# EAGLE board rf_test (EAGLE 5.12)
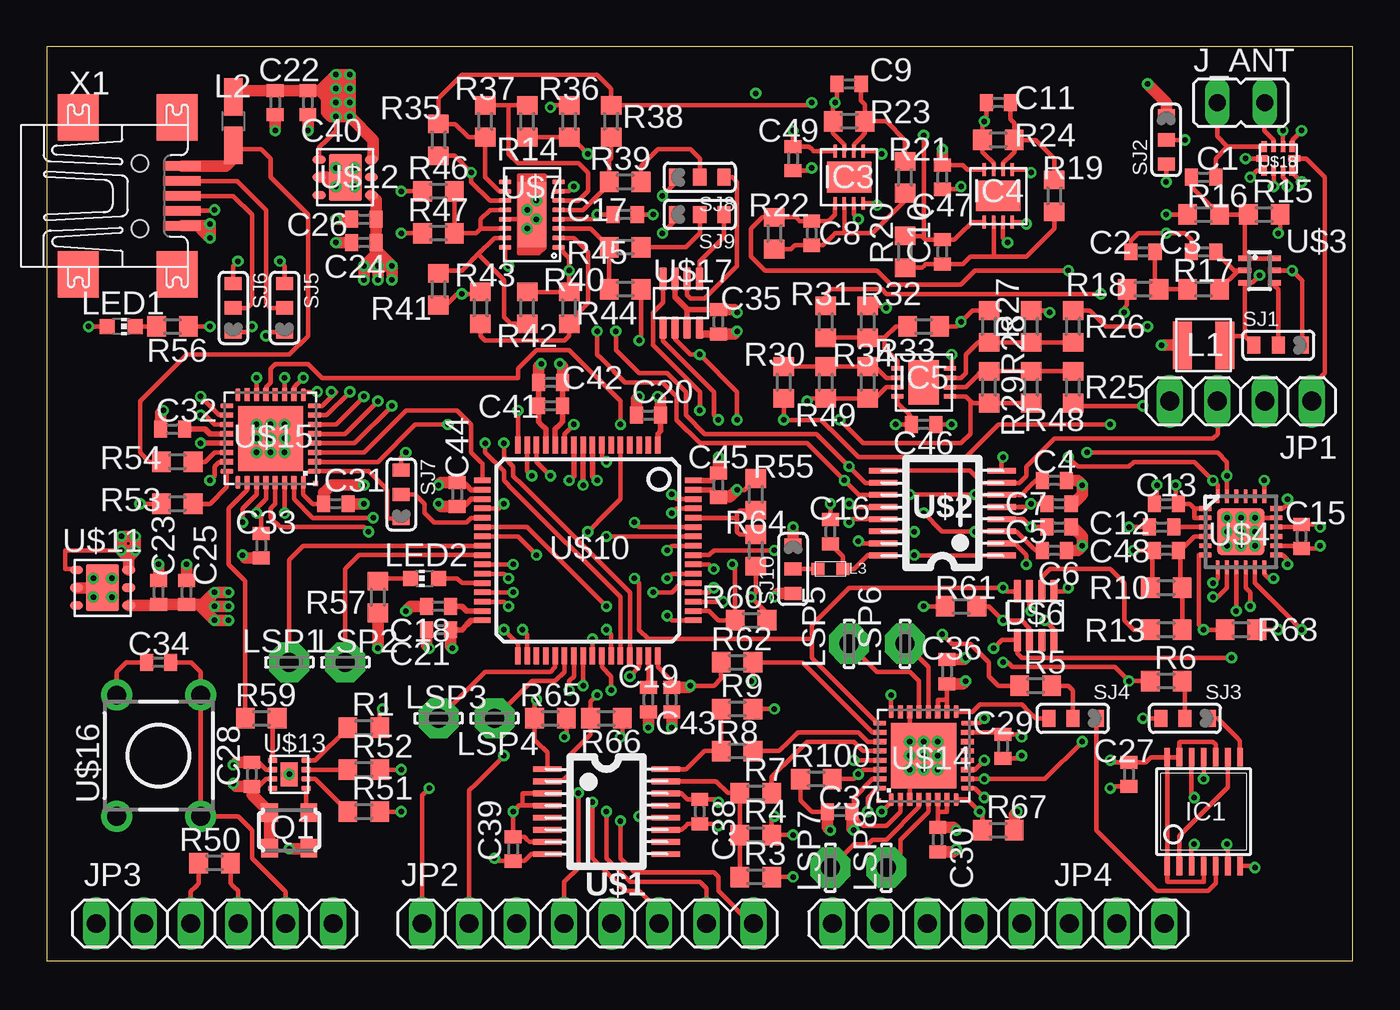
[diagram p4: board, top side]
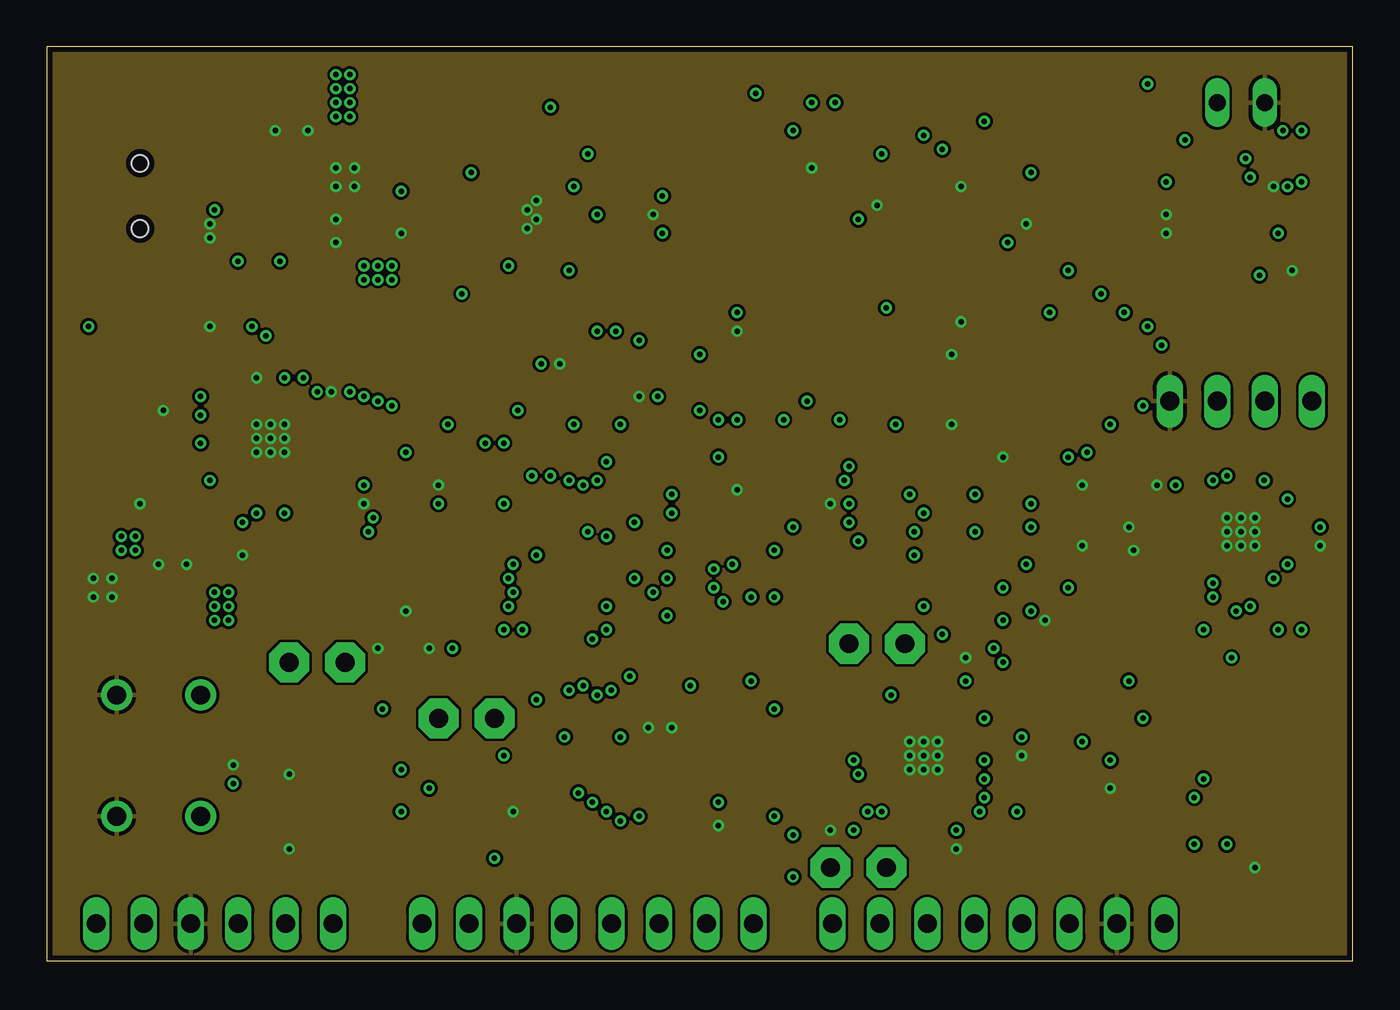
[diagram p5: board, inner layer Route2]
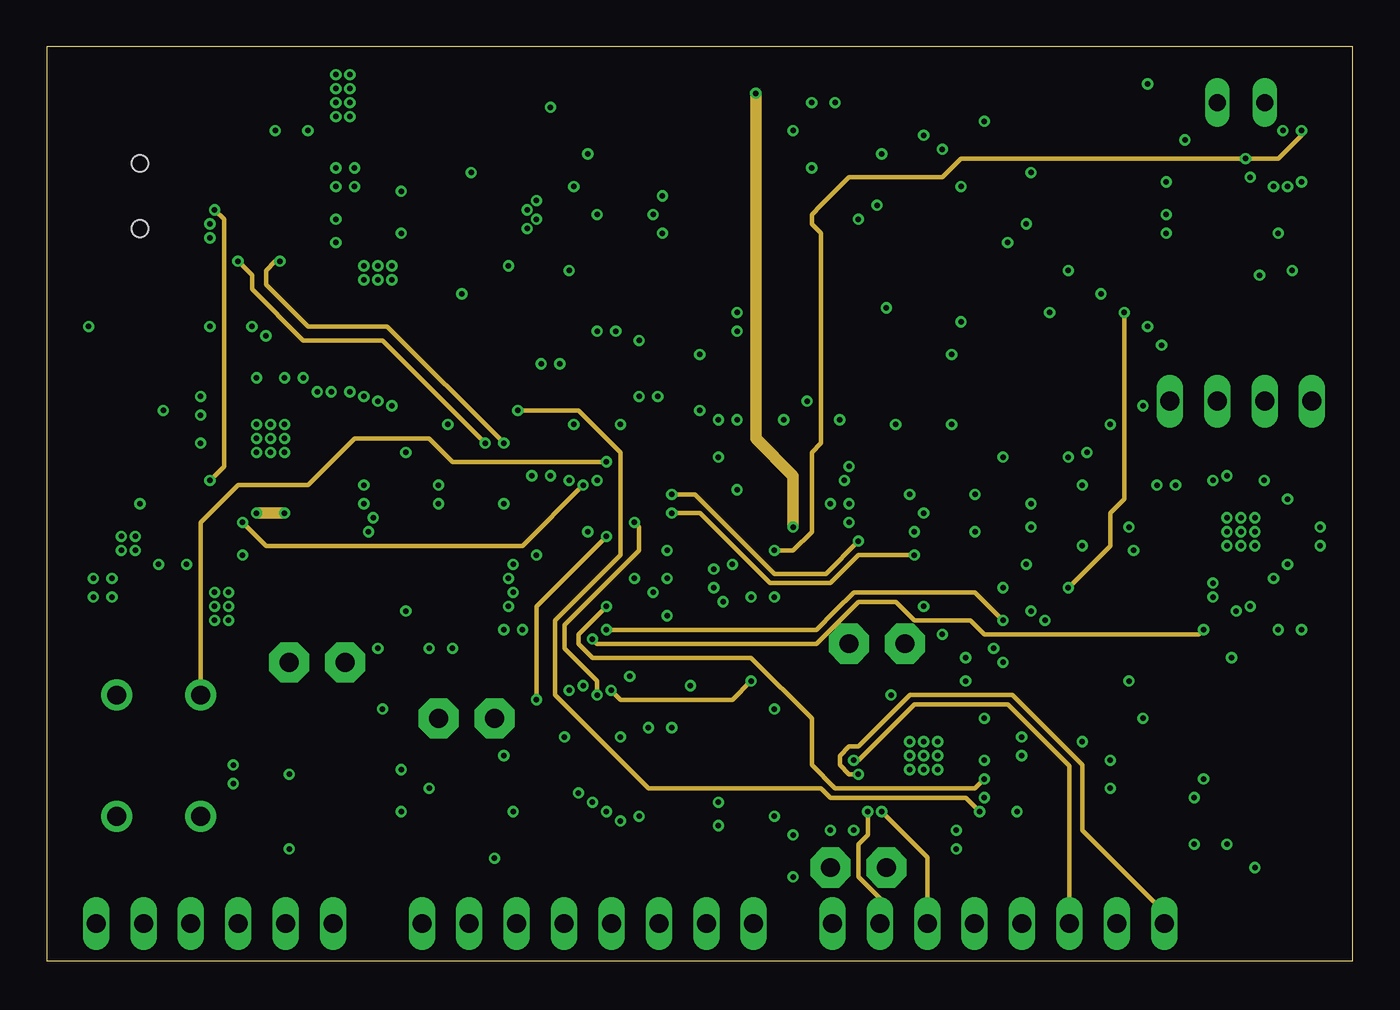
[diagram p6: board, inner layer Route3]
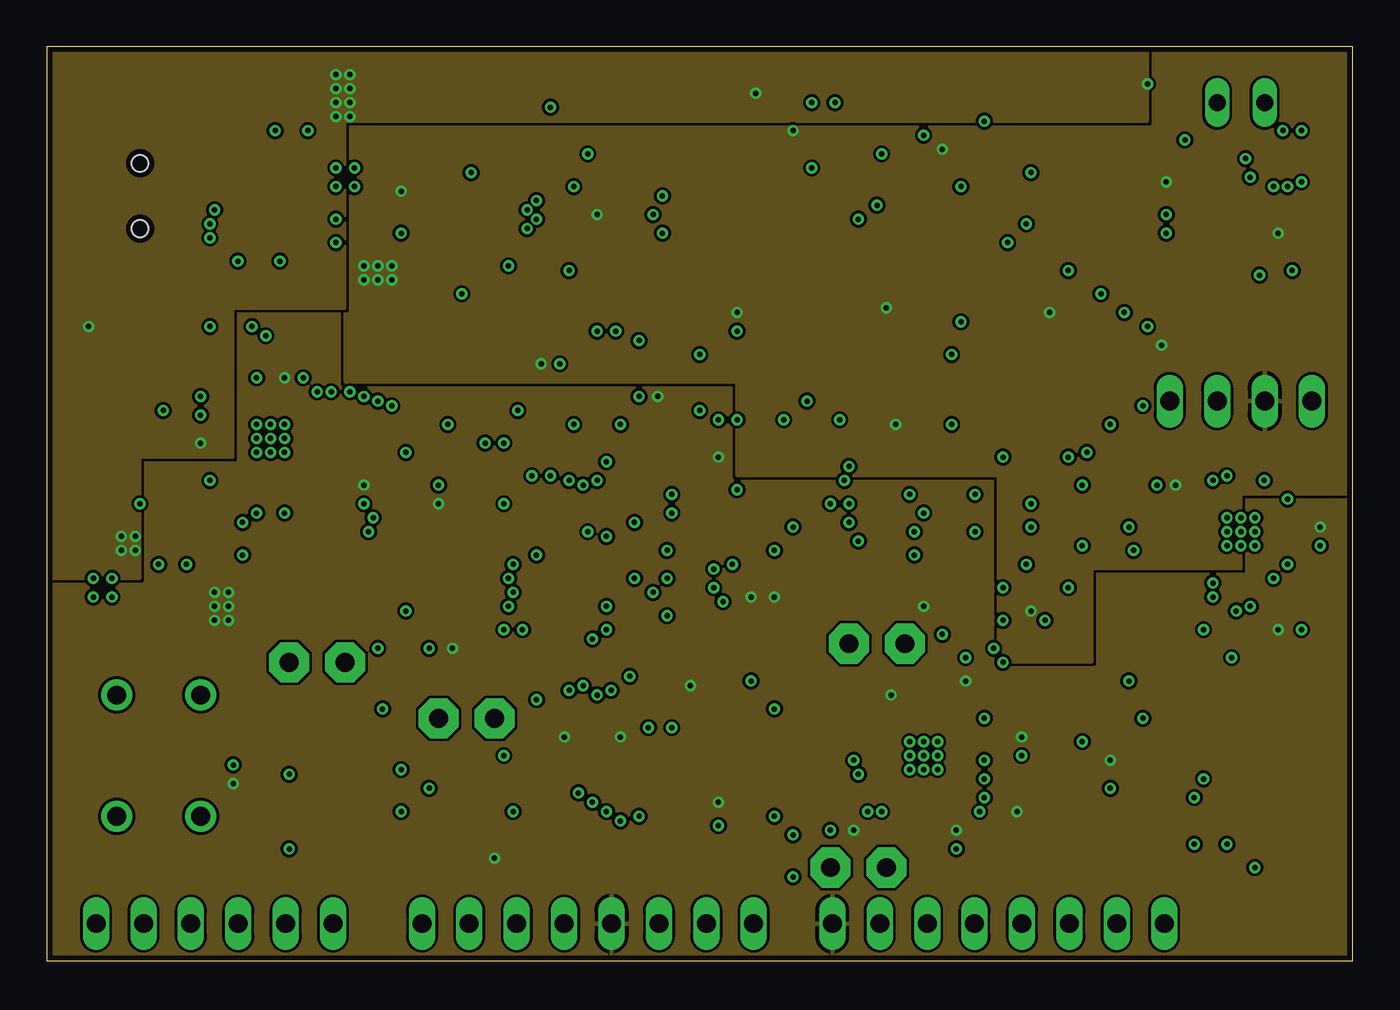
[diagram p7: board, inner layer Route14]
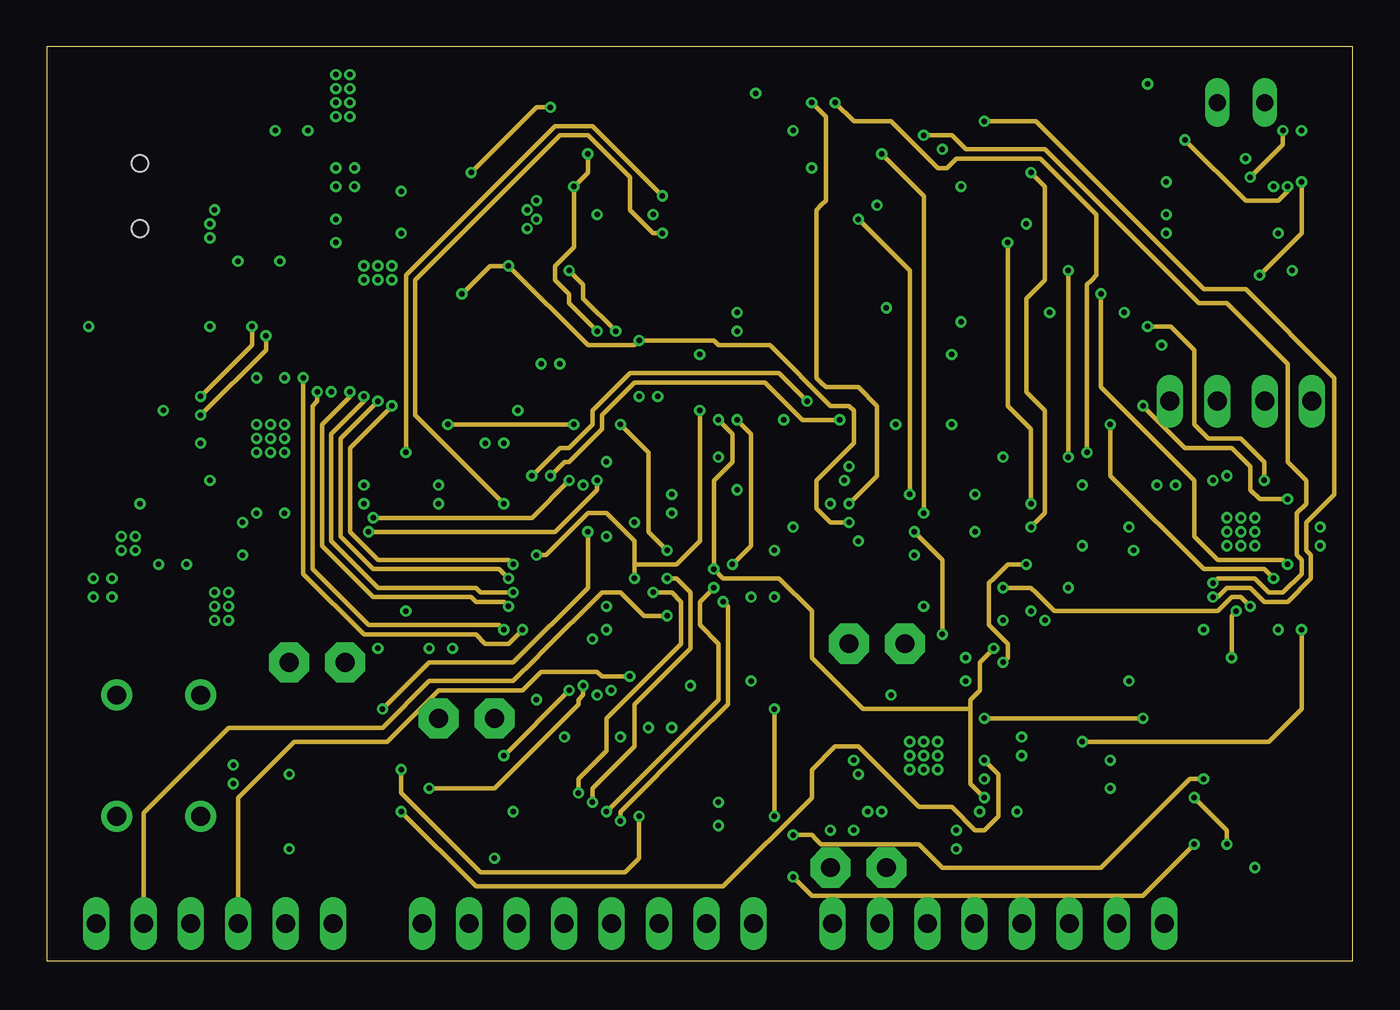
[diagram p8: board, inner layer Route15]
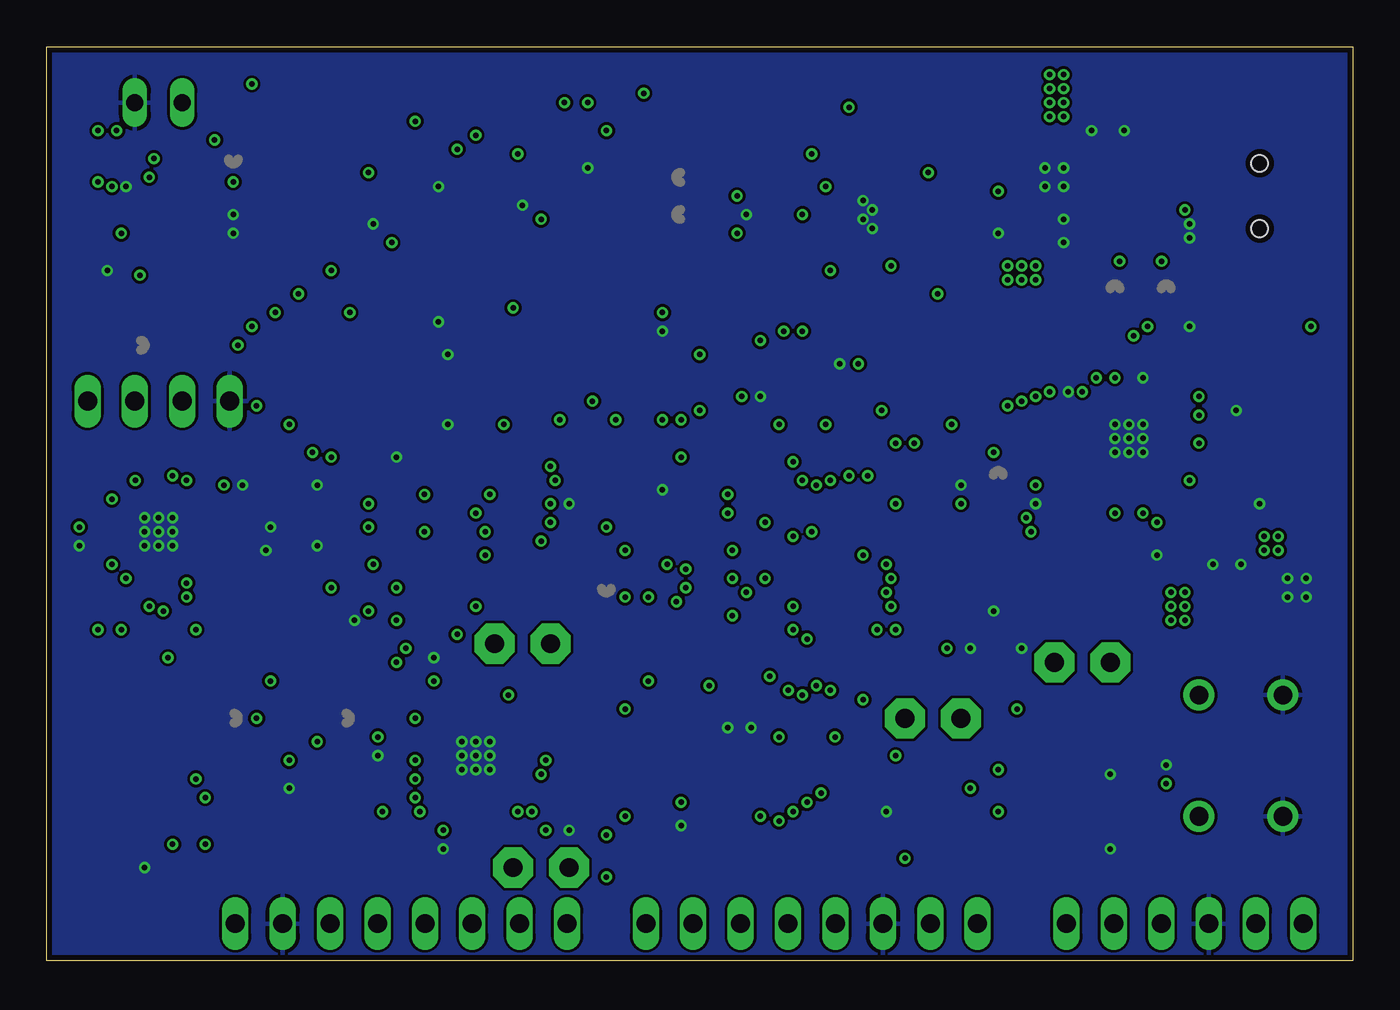
[diagram p9: board, bottom side, seen from below]

Size 70 x 49 mm. Coordinates in mm from the lower left corner, seen from the top.
Outline: 0,0 70,0 70,49 0,49 0,0
Copper layers (1+2+3*14+15+16): Top 0.035mm / dielectric 0.2mm / Route2 0.035mm / dielectric 0.36mm / Route3 0.035mm / dielectric 0.28mm / Route14 0.035mm / dielectric 0.36mm / Route15 0.035mm / dielectric 0.2mm / Bottom 0.035mm
Design rules "PCB-POOL Standard_ML6 *": minimum track width 0.15mm, minimum drill 0.3mm, track to track 0.15mm, track to pad 0.15mm, pad to pad 0.15mm, via to via 0.15mm, smd to smd 0.15mm, copper to edge 0.3mm, drill to drill 0.2mm, minimum pad ring 0.2mm, minimum via ring 0.15mm, stop-mask expansion 0.075mm, vias tented up to drill 0mil, thermal gap 0.2mm

## Footprints (pad centres in the part's own frame; a part is rotated, then mirrored left to right if it is on the bottom)
C0402 = smd 0.7 x 0.9: 1 -0.65,0; 2 0.65,0
TSSOP14 = smd 0.305 x 0.991: 1 -1.95,-2.918; 2 -1.3,-2.918; 3 -0.65,-2.918; 4 0,-2.918; 5 0.65,-2.918; 6 1.3,-2.918; 7 1.95,-2.918; 8 1.95,2.918; 9 1.3,2.918; 10 0.65,2.918; 11 0,2.918; 12 -0.65,2.918; 13 -1.3,2.918; 14 -1.95,2.918
DFN8-3X3 = smd 0.25 x 0.7: 1 -0.75,-1.4; 2 -0.25,-1.4; 3 0.25,-1.4; 4 0.75,-1.4; 5 0.75,1.4; 6 0.25,1.4; 7 -0.25,1.4; 8 -0.75,1.4 | smd 2.38 x 1.65: EXP 0,0
JP1 = drill 0.914 long: 1 0,-1.27; 2 0,1.27
1X04 = drill 1.016 long: 1 -3.81,0; 2 -1.27,0; 3 1.27,0; 4 3.81,0
1X08 = drill 1.016 long: 1 -8.89,0; 2 -6.35,0; 3 -3.81,0; 4 -1.27,0; 5 1.27,0; 6 3.81,0; 7 6.35,0; 8 8.89,0
1X06 = drill 1.016 long: 1 -6.35,0; 2 -3.81,0; 3 -1.27,0; 4 1.27,0; 5 3.81,0; 6 6.35,0
L1008 = smd 1.016 x 2.54: 1 -1.143,0; 2 1.143,0
L0805 = smd 2 x 1: 1 -1.3,0; 2 1.3,0
L0603 = smd 0.7 x 0.65: 1 -0.675,0; 2 0.675,0
CHIP-LED0603 = smd 0.8 x 0.8: A 0,-0.75; C 0,0.75
LSP10 = drill 1.016 pad 2.159 octagon: MP 0,0
ASEMB = smd 0.9 x 1: 1 -1.05,-0.95; 2 1.05,-0.95; 3 1.05,0.95; 4 -1.05,0.95
R0603 = smd 1 x 1.1: 1 -0.85,0; 2 0.85,0
SJ_2_0402 = smd 0.7 x 0.9: 1 -1.3,0; 2 0,0; 3 1.3,0
TSSOP16 = smd 0.305 x 1.524: 1 -2.275,-3.169; 2 -1.625,-3.169; 3 -0.975,-3.169; 4 -0.325,-3.169; 5 0.325,-3.169; 6 0.975,-3.169; 7 1.625,-3.169; 8 2.275,-3.169; 9 2.275,3.169; 10 1.625,3.169; 11 0.975,3.169; 12 0.325,3.169; 13 -0.325,3.169; 14 -0.975,3.169; 15 -1.625,3.169; 16 -2.275,3.169
SOT363_INFINEON = smd 0.3 x 0.7: 1 -0.65,-0.8; 2 0,-0.8; 3 0.65,-0.8; 4 0.65,0.8; 5 0,0.8; 6 -0.65,0.8
QFN24_4X4MM = smd 0.7 x 0.25: 1 -1.9,1.25; 2 -1.9,0.75; 3 -1.9,0.25; 4 -1.9,-0.25; 5 -1.9,-0.75; 6 -1.9,-1.25; 13 1.9,-1.25; 14 1.9,-0.75; 15 1.9,-0.25; 16 1.9,0.25; 17 1.9,0.75; 18 1.9,1.25 | smd 0.25 x 0.7: 7 -1.25,-1.9; 8 -0.75,-1.9; 9 -0.25,-1.9; 10 0.25,-1.9; 11 0.75,-1.9; 12 1.25,-1.9; 19 1.25,1.9; 20 0.75,1.9; 21 0.25,1.9; 22 -0.25,1.9; 23 -0.75,1.9; 24 -1.25,1.9 | smd 2.54 x 2.54: PAD 0,0
TSOT23-8 = smd 0.4 x 1.22: 1 -0.975,-1.31; 2 -0.325,-1.31; 3 0.325,-1.31; 4 0.975,-1.31; 5 0.975,1.31; 6 0.325,1.31; 7 -0.325,1.31; 8 -0.975,1.31
DFN16_5X3MM = smd 0.25 x 0.65: 1 -1.75,-1.425; 2 -1.25,-1.425; 3 -0.75,-1.425; 4 -0.25,-1.425; 5 0.25,-1.425; 6 0.75,-1.425; 7 1.25,-1.425; 8 1.75,-1.425; 9 1.75,1.425; 10 1.25,1.425; 11 0.75,1.425; 12 0.25,1.425; 13 -0.25,1.425; 14 -0.75,1.425; 15 -1.25,1.425; 16 -1.75,1.425 | smd 3.5 x 1.5: PAD 0,0
LQFP-ST-64-2 = smd 0.9 x 0.3: 1 -5.65,3.75; 2 -5.65,3.25; 3 -5.65,2.75; 4 -5.65,2.25; 5 -5.65,1.75; 6 -5.65,1.25; 7 -5.65,0.75; 8 -5.65,0.25; 9 -5.65,-0.25; 10 -5.65,-0.75; 11 -5.65,-1.25; 12 -5.65,-1.75; 13 -5.65,-2.25; 14 -5.65,-2.75; 15 -5.65,-3.25; 16 -5.65,-3.75; 33 5.65,-3.75; 34 5.65,-3.25; 35 5.65,-2.75; 36 5.65,-2.25; 37 5.65,-1.75; 38 5.65,-1.25; 39 5.65,-0.75; 40 5.65,-0.25; 41 5.65,0.25; 42 5.65,0.75; 43 5.65,1.25; 44 5.65,1.75; 45 5.65,2.25; 46 5.65,2.75; 47 5.65,3.25; 48 5.65,3.75 | smd 0.3 x 0.9: 17 -3.75,-5.65; 18 -3.25,-5.65; 19 -2.75,-5.65; 20 -2.25,-5.65; 21 -1.75,-5.65; 22 -1.25,-5.65; 23 -0.75,-5.65; 24 -0.25,-5.65; 25 0.25,-5.65; 26 0.75,-5.65; 27 1.25,-5.65; 28 1.75,-5.65; 29 2.25,-5.65; 30 2.75,-5.65; 31 3.25,-5.65; 32 3.75,-5.65; 49 3.75,5.65; 50 3.25,5.65; 51 2.75,5.65; 52 2.25,5.65; 53 1.75,5.65; 54 1.25,5.65; 55 0.75,5.65; 56 0.25,5.65; 57 -0.25,5.65; 58 -0.75,5.65; 59 -1.25,5.65; 60 -1.75,5.65; 61 -2.25,5.65; 62 -2.75,5.65; 63 -3.25,5.65; 64 -3.75,5.65
DFN6-3X3 = smd 0.45 x 0.7: 1 -0.95,-1.4; 2 0,-1.4; 3 0.95,-1.4; 4 0.95,1.4; 5 0,1.4; 6 -0.95,1.4 | smd 2.5 x 1.75: EXP 0,0
DFN8-3X3' = smd 0.3 x 0.5: 1 -0.75,-0.9; 2 -0.25,-0.9; 3 0.25,-0.9; 4 0.75,-0.9; 5 0.75,0.9; 6 0.25,0.9; 7 -0.25,0.9; 8 -0.75,0.9 | smd 1.3 x 0.9: EXP 0,0
HVQFN32 = smd 0.7 x 0.28: 1 -2.35,1.75; 2 -2.35,1.25; 3 -2.35,0.75; 4 -2.35,0.25; 5 -2.35,-0.25; 6 -2.35,-0.75; 7 -2.35,-1.25; 8 -2.35,-1.75; 17 2.35,-1.75; 18 2.35,-1.25; 19 2.35,-0.75; 20 2.35,-0.25; 21 2.35,0.25; 22 2.35,0.75; 23 2.35,1.25; 24 2.35,1.75 | smd 0.28 x 0.7: 9 -1.75,-2.35; 10 -1.25,-2.35; 11 -0.75,-2.35; 12 -0.25,-2.35; 13 0.25,-2.35; 14 0.75,-2.35; 15 1.25,-2.35; 16 1.75,-2.35; 25 1.75,2.35; 26 1.25,2.35; 27 0.75,2.35; 28 0.25,2.35; 29 -0.25,2.35; 30 -0.75,2.35; 31 -1.25,2.35; 32 -1.75,2.35 | smd 3.5 x 3.5: EXP 0,0 | smd 0.25 x 0.25: M1 -2.415,2.415
TL1105 = drill 1 pad 1.676 round: 1 -2.25,3.25; 2 -2.25,-3.25; 3 2.25,-3.25; 4 2.25,3.25
R-PUQFN-N10 = smd 0.3 x 0.58: 1 -0.75,-0.635; 4 0.75,-0.635; 6 0.75,0.635; 9 -0.75,0.635 | smd 0.25 x 0.58: 2 -0.25,-0.635; 3 0.25,-0.635; 7 0.25,0.635; 8 -0.25,0.635 | smd 0.63 x 0.35: 5 0.86,0; 10 -0.86,0
UX60-MB-5ST = smd 2 x 0.5: 1 2.25,1.6; 2 2.25,0.8; 3 2.25,0; 4 2.25,-0.8; 5 2.25,-1.6 | smd 2.2 x 2.5: M1 -3.3,-4.2; M2 -3.3,4.2; M3 2,4.2; M4 2,-4.2 | hole 0.9: 0,-1.75; 0,1.75

## Placement (x,y rotation side)
C1  4n7  [C0402]  62,42 180 top
C2  10n  [C0402]  58.75,38 180 top
C3  10n  [C0402]  62,38 180 top
C4  220p  [C0402]  54,25.75 0 top
C5  220p  [C0402]  54.25,24.5 0 top
C6  220p  [C0402]  54,22 0 top
C7  220p  [C0402]  54.25,23.25 0 top
C8  22p  [C0402]  41,39 90 top
C9  22p  [C0402]  43,47 180 top
C10  22p  [C0402]  48,38 90 top
C11  22p  [C0402]  51,46 180 top
C12  100n  [C0402]  59.75,23.25 180 top
C13  100n  [C0402]  60,24.5 180 top
C15  100n  [C0402]  67.25,22.75 270 top
C16  100n  [C0402]  42,23 90 top
C17  100n  [C0402]  31,40 0 top
C18  2u2  [C0402]  21,19 180 top
C19  2u2  [C0402]  32.25,14 270 top
C20  100n  [C0402]  32.25,29.25 180 top
C21  100n  [C0402]  21,17.75 180 top
C22  4u7  [C0402]  12.25,46 270 top
C23  1u  [C0402]  6,19.75 90 top
C24  1u  [C0402]  17,38.5 180 top
C25  100n  [C0402]  7.5,19.75 90 top
C26  100n  [C0402]  17,39.75 180 top
C27  100n  [C0402]  58,10 270 top
C28  100n  [C0402]  11,10 90 top
C29  100n  [C0402]  51.25,11.5 270 top
C30  100n  [C0402]  47.75,6.5 270 top
C31  100n  [C0402]  15.5,24.5 0 top
C32  1u  [C0402]  6.75,28.5 180 top
C33  1u  [C0402]  11.5,22.25 270 top
C34  100n  [C0402]  6,16 180 top
C35  100n  [C0402]  36,34.25 270 top
C36  100n  [C0402]  48.25,15.5 90 top
C37  100n  [C0402]  42.5,8 180 top
C38  100n  [C0402]  35,8 270 top
C39  100n  [C0402]  25,6 90 top
C40  100n  [C0402]  14,46 270 top
C41  100n  [C0402]  27,29.75 0 top
C42  1u  [C0402]  27,31 0 top
C43  100n  [C0402]  33.5,14 270 top
C44  1u  [C0402]  22,25 90 top
C45  100n  [C0402]  36,25.5 270 top
C46  100n  [C0402]  47,28.75 0 top
C47  100n  [C0402]  48,42 270 top
C48  100n  [C0402]  60,22 180 top
C49  100n  [C0402]  40,43 270 top
IC1  7474  [TSSOP14]  62,8 0 top
IC3  LT6231  [DFN8-3X3]  43,42 0 top
IC4  LT6231  [DFN8-3X3]  51,41 0 top
IC5  LT6231  [DFN8-3X3]  47,31 90 top
J_ANT  [JP1]  64,46 90 top
JP1  [1X04]  64,30 180 top
JP2  [1X08]  29,2 180 top
JP3  [1X06]  9,2 0 top
JP4  [1X08]  51,2 0 top
L1  2u2  [L1008]  62,33 0 top
L2  BLM21AG102  [L0805]  10,45 90 top
L3  BLM18AG102  [L0603]  42,21 0 top
LED1  [CHIP-LED0603]  4,34 270 top
LED2  [CHIP-LED0603]  20.25,20.5 90 top
LSP1  LSP10  [LSP10]  13,16 0 top
LSP2  LSP10  [LSP10]  16,16 0 top
LSP3  LSP10  [LSP10]  21,13 0 top
LSP4  LSP10  [LSP10]  24,13 0 top
LSP5  LSP10  [LSP10]  43,17 90 top
LSP6  LSP10  [LSP10]  46,17 90 top
LSP7  LSP10  [LSP10]  42,5 90 top
LSP8  LSP10  [LSP10]  45,5 90 top
Q1  ASFL1  [ASEMB]  13,7 0 top
R1  30  [R0603]  17,12.5 0 top
R3  30  [R0603]  38,4.5 0 top
R4  30  [R0603]  38,6.75 0 top
R5  30  [R0603]  53,14.75 0 top
R6  30  [R0603]  60,15 0 top
R7  30  [R0603]  38,9 0 top
R8  30  [R0603]  37,11.25 0 top
R9  30  [R0603]  37,13.5 0 top
R10  87k  [R0603]  60,20 0 top
R13  115k  [R0603]  60,17.75 0 top
R14  2k2  [R0603]  25.75,45 90 top
R15  100k  [R0603]  65.25,40 0 top
R16  100k  [R0603]  62,40 0 top
R17  2k7  [R0603]  62,36 180 top
R18  8k2  [R0603]  58.75,36 180 top
R19  560  [R0603]  54,41 270 top
R20  8k2  [R0603]  46,38 90 top
R21  560  [R0603]  46,42 270 top
R22  8k2  [R0603]  39,39 90 top
R23  8k2  [R0603]  43,45 180 top
R24  8k2  [R0603]  51,44 180 top
R25  1k  [R0603]  55,30.75 90 top
R26  1k  [R0603]  55,34 270 top
R27  2k2  [R0603]  52.75,34 90 top
R28  2k2  [R0603]  50.5,34 270 top
R29  2k2  [R0603]  50.5,30.75 270 top
R30  1k  [R0603]  39.5,31 90 top
R31  1k  [R0603]  41.75,34.25 270 top
R32  2k2  [R0603]  44,34.25 90 top
R33  2k2  [R0603]  47,34 180 top
R34  2k2  [R0603]  44,31 270 top
R35  2k2  [R0603]  21,44 270 top
R36  2k2  [R0603]  28,45 90 top
R37  2k2  [R0603]  23.5,45 90 top
R38  10k  [R0603]  30.25,45 270 top
R39  10k  [R0603]  31,41.75 180 top
R40  2k2  [R0603]  28,35 270 top
R41  2k2  [R0603]  21,36 90 top
R42  2k2  [R0603]  25.75,35 270 top
R43  2k2  [R0603]  23.25,35 270 top
R44  10k  [R0603]  31,36 180 top
R45  10k  [R0603]  31,38.25 180 top
R46  10k  [R0603]  21,41.25 180 top
R47  10k  [R0603]  21,39 0 top
R48  2k2  [R0603]  52.75,30.75 270 top
R49  2k2  [R0603]  41.75,31 270 top
R50  100k  [R0603]  9,5.25 0 top
R51  30  [R0603]  17,8 0 top
R52  30  [R0603]  17,10.25 0 top
R53  8k04  [R0603]  7,24.5 0 top
R54  20k  [R0603]  7,26.75 0 top
R55  100k  [R0603]  38,25 270 top
R56  1k5  [R0603]  6.75,34 180 top
R57  470  [R0603]  17.75,19.5 90 top
R59  30  [R0603]  11.5,13 180 top
R60  10k  [R0603]  37.75,18.25 0 top
R61  10k  [R0603]  49,19 180 top
R62  10k  [R0603]  37,16 180 top
R63  10k  [R0603]  64,17.75 0 top
R64  100k  [R0603]  38,22 270 top
R65  4k7  [R0603]  27,13 0 top
R66  4k7  [R0603]  30,13 0 top
R67  10k  [R0603]  51,7 0 top
R100  4k7  [R0603]  41.25,9.75 0 top
SJ1  [SJ_2_0402]  66,33 0 top
SJ2  [SJ_2_0402]  60,44 90 top
SJ3  [SJ_2_0402]  61,13 0 top
SJ4  [SJ_2_0402]  55,13 0 top
SJ5  [SJ_2_0402]  12.75,35 270 top
SJ6  [SJ_2_0402]  10,35 270 top
SJ7  [SJ_2_0402]  19,25 270 top
SJ8  [SJ_2_0402]  35,42 180 top
SJ9  [SJ_2_0402]  35,40 180 top
SJ10  [SJ_2_0402]  40,21 90 top
U$1  FS7140  [TSSOP16]  30,8 270 top
U$2  FST3253  [TSSOP16]  48,24 90 top
U$3  BF1102  [SOT363_INFINEON]  65,37 270 top
U$4  LTC6602  [QFN24_4X4MM]  64,23 0 top
U$6  LTC2632  [TSOT23-8]  53,18.5 0 top
U$7  LTC6088  [DFN16_5X3MM]  26,40 90 top
U$10  STM32F4_64  [LQFP-ST-64-2]  29,22 270 top
U$11  LD39050  [DFN6-3X3]  3,20 270 top
U$12  LD39050  [DFN6-3X3]  16,42 270 top
U$13  NB3N511  [DFN8-3X3']  13,10 90 top
U$14  X02_256  [HVQFN32]  47,11 90 top
U$15  USB3340  [HVQFN32]  12,28 180 top
U$16  TL1105  [TL1105]  6,11 0 top
U$17  LTC2632  [TSOT23-8]  34,35.25 0 top
U$18  TS5A23159  [R-PUQFN-N10]  66,43 180 top
X1  MINI-USB-SHIELD-UX60-MB-5ST  [UX60-MB-5ST]  5,41 0 top

## Tracks (layer width: path | path; a pad name or v marks a point on that pad's centre or on a via)
3V3_A  (via drill 0.3)
  Top 0.254: R15.2 66.1,39.1 v66,39 | SJ2.1 v60,41.75 | U$4.2 61.5,23.75 61.5,24 61.5,24.25 | 61.5,24.25 61.25,24.5 C13.1 60.5,24.65 v60.5,25.5 | 61.5,24.25 U$4.1 | IC4.8 49.35,42.4 49.25,42.5 49.1,42.65 C47.1 | IC3.8 41.1,43.4 41,43.5 40.85,43.65 C49.1 v40,44.5 | v45.5,28.75 C46.1 46.35,29.15 46.25,29.25 45.6,29.9 IC5.8 | U$7.4 29.25,39.75 v29.5,40 C17.1 | R46.2 v19,41.25 | U$6.7 52.67,18.82 v52.75,18.75 | R32.2 44.9,35.1 v45,35 | R27.2 53.65,34.85 v53.75,34.75
  Top 0.305: U$10.13 26.75,28.5 26.5,28.75 26.35,28.9 C41.1 C42.1 | U$17.7 33.67,35.58 34.25,35 34.33,34.92 | U$17.3 34.33,34.92 | C35.1 34.35,34.9 34.33,34.92
  Top 0.61: C47.1 v48,43.5 | U$12.4 17.65,40.8 C26.1 C24.1 17.65,38.1 17.88,37.88 | C42.1 26.35,31.85 v26.5,32 | C35.1 36.85,34.9 v37,34.75 | v17,37.25 v17,36.5 | v17.75,37.25 v17.75,36.5 | v18.5,37.25 v18.5,36.5 | v17.75,37.25 v18.5,37.25 | v17,37.25 v17.75,37.25 | v17,37.25 17.75,38 | 17.75,38 17.88,37.88 | 17.88,37.88 v18.5,37.25 | v17.75,37.25 17.75,38 | L1.1 v59.75,33
  pour Route14 (rank 2): 16,49 70,49 70,25 64,25 64,21 56,21 56,16 51,16 51,26 37,26 37,31 16,31
3V3_D  (via drill 0.3)
  Top 0.254: v57,10.75 57,10.65 C27.1 58.9,10.65 59,10.75 59.17,10.92 IC1.14 | U$4.16 67.1,23.25 C15.1 68.1,23.4 v68.25,23.25 | R63.2 v66,17.75 | IC1.14 IC1.13 60.7,11.7 60.75,11.75 62.5,11.75 62.65,11.6 IC1.10 | IC1.14 IC1.1 60.05,4.25 60.25,4.25 62,4.25 IC1.4 | U$14.15 51.15,12.25 C29.1 52.1,12.15 v52.25,12 | C30.1 47.75,8 | 47.75,8 U$14.6 | U$14.7 48.25,8 47.75,8 | U$14.2 45.75,8 45,7.25 43.75,7.25 43.25,7.75 43.25,8 | 43.25,8 43.25,8.75 44.25,9.75 U$14.31 | C37.1 43,8 C37.1 | C37.1 43.25,8 | 48.25,14 C36.1 | 48.25,14 U$14.18 | U$14.19 47.75,14 48.25,14 | U$14.24 v45.25,14.25 | v36,8.5 35.85,8.65 C38.1 34.35,8.65 34.25,8.75 34.02,8.97 U$1.14 | U$1.8 25.98,5.72 25.75,5.5 25.6,5.35 C39.1 24.15,5.35 v24,5.5 | U$10.48 32.75,15.75 33.25,15.25 33.5,15 C43.1 | R64.2 38,19.75 v37.75,19.5 38.6,18.65 R60.2 | U$13.7 11.75,9.75 11.5,9.5 11.35,9.35 C28.1 | U$15.32 13.75,25 14.25,24.5 C31.1 | R61.2 v47,19 | R65.2 27.85,12.1 v27.75,12 | R66.2 30.85,12.1 v30.75,12 | U$15.11 v12.75,31.25 | R62.2 36.15,15.15 35.75,14.75 v34.5,14.75
  Top 0.305: U$10.32 22.75,18.25 22.5,18 22.25,17.75 C21.1 | U$10.1 32.75,28.25 32.9,28.4 C20.1 | U$10.64 35.6,25.75 C45.1 | U$10.19 22.75,24.75 22.5,24.5 22.35,24.35 C44.1
  Top 0.61: R67.2 51.85,7.85 v52,8 | C30.1 48.6,7.15 v48.75,7 | C37.1 43.15,7.1 v43.25,7 | C43.1 34.4,14.65 v34.5,14.75 | SJ10.1 39.2,19.7 v39,19.5 | v10,9.5 10.15,9.35 C28.1 11,8.9 Q1.4 Q1.1 | v17,25.5 16.75,25.5 15.25,25.5 15,25.25 14.85,25.1 C31.1 | C21.1 21.65,16.85 v21.75,16.75 | C20.1 32.9,30.1 v32.75,30.25 | C45.1 v36,27 | C44.1 21.15,24.35 v21,24.5 | U$11.4 5.95,19.05 C23.1 C25.1 8.35,19.1 v9,19.75 v9.75,19.75 | 8.25,19 v9,18.25 v9.75,18.25 | v9,19 v9.75,19 | C36.1 49.1,14.85 v49.25,15
  pour Route14 (rank 3): 0,49 70,49 70,0 0,0
5V_USB  (via drill 0.3)
  Top 0.254: LED1.A 2.5,34 v2.25,34 | v4,22 1,22 1,21.5 1,21 1.55,21 U$11.1 | U$12.1 14.6,43.6 15,44 15.5,44.5 v15.5,45.25
  Top 0.305: U$15.21 v8.25,27.75
  Top 0.61: v59,47 60,46 SJ2.3 | SJ10.3 v40,23.25 | v16.25,45.25 17.5,44 17.5,43.05 U$12.6 | L2.2 10.35,46.65 C22.1 C40.1 14.65,46.65 v15.5,47.5 | v4,22 4.35,21.65 4.4,21.6 U$11.6 | v4,22 v4.75,22 | v4.75,22 4.5,21.75 | v4,22 v4,22.75 v4.75,22.75 v4.75,22 | v15.5,45.25 15.25,45.25 15,45.5 15,46.25 14.75,46.5 | v15.5,46 v15.5,45.25 | v15.5,46.75 v15.5,46 | v15.5,47.5 v15.5,46.75 | v16.25,46 v16.25,45.25 | v16.25,46.75 v16.25,46 | v16.25,46.75 v16.25,47.5 v15.5,47.5 | v15.5,46.75 v16.25,46.75 | v16.25,46 v15.5,46 | v15.5,45.25 v16.25,45.25 | v15.5,47.5 v16.25,46.75 | v16.25,46.75 v15.5,46 | v15.5,46 v16.25,45.25 | v15.5,46.75 15.25,46.5
  Route3 0.61: v40,23.25 40,26 38,28 v38,46.5
  pour Route14: 59,49 0,49 0,20.5 5,20.5 5,27 10,27 10,35 16,35 16,45 59,45
5V_USB_UNFILTERED
  Top 0.254: 5.5,26.75 R54.1 5.5,26.75 | 10,43.5 11.5,43.5 12,43 12,42 14,40 14,33.5 13,32.5 7.5,32.5 5,30 5,27.25 5.5,26.75
  Top 0.61: X1.1 9.6,42.6 10,43 10,43.1 10,43.5 L2.1
!MIXER_OE_1  (via drill 0.3)
  Top 0.254: U$10.61 33.75,24.25 v33.5,24 | U$2.1 46.52,21.73 v46.5,21.75
  Route3 0.254: v46.5,21.75 43.5,21.75 42,20.25 38.75,20.25 35,24 v33.5,24
!MIXER_OE_2  (via drill 0.3)
  Top 0.254: U$2.15 43.62,22.38 v43.5,22.5 | U$10.62 33.75,24.75 v33.5,25
  Route3 0.254: v43.5,22.5 41.75,20.75 39,20.75 34.75,25 v33.5,25
!RST  (via drill 0.3)
  Top 0.254: U$15.27 11.25,25 10.5,24.25 v10.5,23.5
  Top 0.305: v28.75,25.5 U$10.9
  Route3 0.254: v10.5,23.5 11.5,22.5 11.75,22.25 25.5,22.25 v28.75,25.5
!SPI_FASTDAC_CS  (via drill 0.3)
  Top 0.254: U$10.50 35.5,18.75 35.75,18.5 36,18.25 R60.1 36.9,21.1 v36.75,21.25 | U$17.2 33.67,33.33 34.5,32.5 v35,32.5 37,30.5 v37,29
  Route15 0.254: v37,29 37.75,28.25 37.75,22.25 v36.75,21.25
!SPI_FPGA_CFG_CS  (via drill 0.3)
  Top 0.254: U$14.26 44.25,12.25 40.5,16 R62.1 37.85,15.1 v37.75,15 | v30.25,14.5 30.25,15.25 29.75,15.75 U$10.42
  Route3 0.254: v37.75,15 36.75,14 30.75,14 v30.25,14.5
!SPI_FPGA_COM_CS  (via drill 0.3)
  Top 0.254: U$14.8 49.35,8.65 v50,8 50.15,7.85 R67.1 | v25.25,29.5 U$10.16
  Route3 0.254: v25.25,29.5 28.5,29.5 30.75,27.25 30.75,21.75 28,19 | 27.25,18.25 28,19 | 27.25,18.25 28,19 | 27.25,18.25 28,19 | 27.25,18.25 27.25,16 27.25,14.75 27.25,14.25 32.25,9.25 41.5,9.25 42,8.75 44.75,8.75 45,8.75 49.25,8.75 v50,8
!SPI_LP_CS  (via drill 0.3)
  Top 0.254: U$4.6 61.75,21.75 61.75,18 v62,17.75 62.25,17.75 62.5,17.75 R63.1 | U$10.41 v29.25,17.25
  Route3 0.254: v29.25,17.25 29.5,17 41.25,17 43.5,19.25 45.5,19.25 46.5,18.25 49.5,18.25 50.25,17.5 61.75,17.5 v62,17.75
!SPI_SLOWDAC_CS  (via drill 0.3)
  Top 0.254: U$6.2 52.67,17.82 52.25,18.25 v51.25,18.25 50.5,19 R61.1 | U$10.43 30.25,17.5 v30,17.75
  Route3 0.254: v30,17.75 41.25,17.75 42.25,18.75 43.25,19.75 49.75,19.75 v51.25,18.25
!UC_RST  (via drill 0.3)
  Top 0.254: C34.1 7.75,16 8.25,15.5 U$16.4 U$16.3 10.25,7.75 11,7 11,5.5 12,4.5 12.5,4 12.75,3.75 12.81,3.69 JP3.5 | U$10.7 29.75,27 v30,26.75
  Route3 0.254: U$16.4 8.25,23.5 10.25,25.5 14,25.5 16.5,28 20.5,28 21.75,26.75 v30,26.75
AGC_FILTER
  Top 0.254: R17.2 R18.1 59.4,36.2 C2.1
BOOT0
  Top 0.254: R55.2 37.15,24.15 37,24 37,23.75 | R64.1 37.15,22.85 37,23 37,23.75 | 37,23.75 U$10.60
BP_ANT
  Top 0.254: U$18.10 67.5,43 68.5,42 68.5,31.5 67.81,30.81 JP1.1
BP_MIXER
  Top 0.254: U$2.9 49.48,26.27 49.5,26.25 50,25.75 50.12,25.62 U$2.7 52.12,25.62 52.5,26 52.5,26.5 54,28 62.5,28 62.75,28.25 62.75,29.98 JP1.3
BP_VOCM
  Top 0.254: C12.1 U$4.3
CLK
  Top 0.254: SJ7.3 18.3,23.7 18.25,23.75 18.25,25 18.25,25.25 18,25.5 17.75,25.75 17.25,26.25 15.25,26.25 U$15.1
CLK_CLKGEN  (via drill 0.3)
  Top 0.254: U$1.12 31.82,7.67 v31.75,7.75 | v19,10.25 R52.2
  Route15 0.254: v19,10.25 19,9 23.25,4.75 31,4.75 31.75,5.5 v31.75,7.75
CLK_CONTROLLER  (via drill 0.3)
  Top 0.254: R1.2 17.85,13.35 v18,13.5 | U$10.5 30.75,24.75 30,24 v29,23
  Route15 0.254: v29,23 29,20 25,16 20.5,16 v18,13.5
CLK_OSC
  Top 0.254: U$13.1 13.9,8.1 Q1.3
CLK_USB_PHY
  Top 0.254: U$15.26 10.75,25.25 10.5,25 | 10.5,25 10.25,24.75 | R59.2 10.65,20.35 10,21 9.75,21.25 9.75,24.25 10.5,25
CLKN
  Top 0.254: U$14.27 44,11.75 43.5,12.25 40.25,12.25 39.75,11.75 39.25,11.25 R8.2
CLKN_R
  Top 0.254: U$1.16 34.27,10.28 35.25,11.25 R8.1 R9.1
CLKP_1  (via drill 0.3)
  Top 0.254: IC1.3 61.35,6.1 v61.5,6.25 | R3.2 v40,4.5
  Route15 0.254: v40,4.5 41,3.5 58.75,3.5 v61.5,6.25
CLKP_2  (via drill 0.3)
  Top 0.254: v62,9.75 IC1.11 | v40,6.75 R4.2 38.85,7.6 v39,7.75 | v39,13.5 R9.2
  Route15 0.254: v40,6.75 41,6.75 41.25,6.5 41.5,6.25 46.75,6.25 48,5 56.5,5 61.25,9.75 v62,9.75 | v39,7.75 v39,13.5
CLKP_3
  Top 0.254: R7.2 38.85,9.85 40,11 40.25,11.25 40.75,11.75 43.25,11.75 43.75,11.25 U$14.28
CLKP_R
  Top 0.254: U$1.15 35.88,9.62 36.5,9 R7.1 R4.1 R3.1
D0
  Top 0.254: U$15.3 17,27.25 19.25,29.5 20.5,29.5 22,29.5 22.75,28.75 22.75,27.25 23.25,26.75 23.35,26.65 U$10.17
D1  (via drill 0.3)
  Top 0.254: U$15.4 16.5,27.75 v18.5,29.75 | v25,21.25 U$10.26
  Route15 0.254: v18.5,29.75 16.25,27.5 16.25,24 16.25,23 17.75,21.5 22,21.5 24.75,21.5 v25,21.25
D2  (via drill 0.3)
  Top 0.254: U$15.5 16,28.25 v17.75,30 | U$10.27 24.5,20.75 v24.75,20.5
  Route15 0.254: v17.75,30 15.75,28 15.75,23.75 15.75,22.75 17.25,21.25 17.5,21 22,21 24.25,21 v24.75,20.5
D3  (via drill 0.3)
  Top 0.254: U$15.6 15.5,28.75 v17,30.25 | U$10.29 24.75,19.75 v25,19.75
  Route15 0.254: v17,30.25 17,30 15.25,28.25 15.25,22.5 17.25,20.5 17.75,20 22.25,20 23,20 23.25,19.75 v25,19.75
D4  (via drill 0.3)
  Top 0.254: U$15.7 15,29.25 v16.25,30.5 | U$10.30 24.5,19.25 v24.75,19
  Route15 0.254: v16.25,30.5 16.25,30.25 14.75,28.75 14.75,22.25 17.25,19.75 17.5,19.5 22.75,19.5 23,19.25 24.5,19.25 v24.75,19
D5  (via drill 0.3)
  Top 0.254: U$15.9 13.75,30.5 v14.5,30.5 | U$10.33 25.25,17 v24.5,17.75
  Route15 0.254: v14.5,30.5 14.5,30 14.25,29.75 14.25,21 17.25,18 22.5,18 24.25,18 v24.5,17.75
D6  (via drill 0.3)
  Top 0.254: U$15.10 13.25,30.75 13.5,31 v13.75,31.25 | U$10.34 25.75,17.5 v25.5,17.75
  Route15 0.254: v13.75,31.25 13.75,20.75 17,17.5 23,17.5 23.5,17 24.75,17 v25.5,17.75
D7  (via drill 0.3)
  Top 0.254: U$15.13 11.75,30.75 12,31 12,31.25 12,31.75 12.25,32 14,32 14.75,31.25 25.25,31.25 25.25,31.75 26,32.5 26.25,32.75 28,32.75 30.5,30.25 30.75,30 v30.75,28.75 | U$10.57 33.5,22.25 v33.25,22
  Route15 0.254: v33.25,22 32.25,23 32.25,25.75 32.25,27.25 v30.75,28.75
DIR  (via drill 0.3)
  Top 0.254: U$15.31 13.25,25.25 13.25,24.75 14.25,23.75 16.5,23.75 17,23.75 v17.5,23.75
  Top 0.305: U$10.10 28.25,26 v28,25.75
  Route15 0.254: v17.5,23.75 20,23.75 26,23.75 v28,25.75
FF_FEEDBACK
  Top 0.254: IC1.2 60.7,6.7 63,9 63.3,9.3 IC1.9
FF_FEEDFORWARD  (via drill 0.3)
  Top 0.254: IC1.6 63.3,6.2 v63.25,6.25 | IC1.12 61.35,8.9 v61.5,8.75
  Route15 0.254: v63.25,6.25 63.25,7 v61.5,8.75
FGA_CLK  (via drill 0.3)
  Top 0.254: U$14.11 49.75,10.25 v50.25,10.75 | R51.2 v19,8
  Route15 0.254: v19,8 23,4 36.25,4 41,8.75 41,10.25 42.25,11.5 43.5,11.5 46.75,8.25 48.5,8.25 49.75,7 50.25,7 51,7.75 51,10 v50.25,10.75
GND  (via drill 0.3)
  Top 0.254: C27.2 57,9.35 v57,9.25 | U$3.5 v66.75,37 67.3,36.45 SJ1.3 | U$18.3 65.75,44 65.25,44.5 65.25,45.98 J_ANT.1 | U$18.7 v65.75,41.5 | C2.2 58.1,38.6 58.5,39 v60,39 61,39 61.35,38.65 C3.2 | v60,40 R16.1 | C13.2 59.5,24.65 v59.5,25.5 | v58,23.25 C12.2 | v58.25,22 C48.2 59.25,21.9 59.25,20.75 59.25,20.5 59.15,20.4 R10.1 | v68.25,22.25 68.1,22.1 C15.2 67.1,22.25 U$4.14 | U$4.17 v64.75,23.75 | IC1.7 64.67,5.08 v64.75,5 | IC4.4 52.4,39.6 v52.5,39.5 | C47.2 48.85,41.35 v49,41.5 | C49.2 40.85,42.35 v41,42.5 | IC3.4 44.4,40.6 v44.5,40.5 | IC5.4 48.5,31.75 v48.5,32.5 | C46.2 v48.5,28.75 | R33.1 48.75,34 v49,34.25 49.6,34.85 R28.1 | C29.2 52.1,10.85 v52.25,11 | U$14.3 v46.25,10.25 | v46.25,11.75 U$14.22 | R100.1 40.4,8.6 41,8 C37.2 | v36,7.25 35.9,7.35 C38.2 34.35,7.35 34.25,7.25 34.02,7.03 U$1.11 | U$1.7 25.88,6.38 25.75,6.5 25.6,6.65 C39.2 v25,8 | v25,8 25.25,8.25 | 25.5,8.32 25.32,8.32 v25,8 | 25.5,8.32 U$1.4 | U$1.3 25.5,8.97 25.5,8.32 | U$13.6 11.75,10.25 11.5,10.5 11.35,10.65 C28.2 | C17.2 v32.5,40 | U$7.13 25.75,39.75 U$7.PAD | R47.1 v19,39 | U$2.8 51.17,26.92 v51.25,27 | U$6.4 53.98,17.77 v53.5,18.25 | v37,25.25 37.4,25.25 R55.1 | JP3.3 7.73,3.73 8,4 8.15,4.15 R50.1 | C34.2 4.25,16 3.75,15.5 U$16.1 | R56.1 v8.75,34 | U$15.14 v11.25,31.25 | U$15.8 14.75,29.75 15.5,30.5 v15.25,30.5 | v5,24.5 R53.1 | C16.2 v42,24.5
  Top 0.305: U$10.12 27.25,28.5 27.5,28.75 27.65,28.9 C41.2 C42.2 | U$10.63 35.6,25.25 C45.2 | U$10.18 22.75,25.25 22.5,25.5 22.35,25.65 C44.2
  Top 0.406: C35.2 34.98,33.6 U$17.4
  Top 0.61: C37.2 41.85,7.15 v42,7 | C36.2 49.15,16.15 v49.25,16.25 | C30.2 48.6,5.85 v48.75,6 | v32.25,12.5 C19.2 | v33.5,12.5 C43.2 | C28.2 10.15,10.65 v10,10.5 | v13,6 14,6 Q1.2 | C31.2 v17,24.5 | C24.2 v15.5,38.5 | C26.2 v15.5,39.75 | U$12.2 15,42 v15.5,41.5 U$12.EXP | C40.2 v14,44.5 | C22.2 v12.25,44.5 | v8.75,39.5 v8.75,38.75 | v8.75,39.5 v8.75,38.75 | v8.75,38.75 8.25,39.25 | X1.5 8.65,39.4 v8.75,39.5 | v17.75,16.75 R57.1 | C18.2 19.5,19 v19.25,18.75 | C21.2 20.35,16.9 v20.5,16.75 | C42.2 27.65,31.85 v27.5,32 | C20.2 31.6,30.1 v31.75,30.25 | C45.2 36.6,24.85 v37,25.25 | C44.2 21.15,25.65 v21,25.5 | U$11.2 2.5,20 | 2.5,20 U$11.EXP | C23.2 v6,21.25 | C25.2 v7.5,21.25 | C33.2 10.65,21.6 v10.5,21.75 | C35.2 36.85,33.6 v37,33.75 | C4.2 55.25,25.75 v55.5,25.5 55.5,25 55,24.5 C5.2 | C7.2 55,23.25 55.5,22.75 v55.5,22.25 55.25,22 C6.2 | C32.2 6.1,29.35 v6.25,29.5 | 2.5,20 v2.5,19.5 | U$7.PAD v25.75,40.25
  other vias: 13,10 47,11 47,11.75 47.75,11.75 47,10.25 47.75,11 47.75,10.25 46.25,11 63.25,23.75 64.75,22.25 63.25,22.25 63.25,23 64,23.75 64.75,23 64,23 64,22.25 26.25,40.75 26.25,39.75 25.75,39.25 15.5,42.5 16.5,42.5 16.5,41.5 2.5,20.5 3.5,20.5 3.5,19.5 12,28 11.25,28 11.25,28.75 12,28.75 12.75,28 12.75,27.25 12,27.25 11.25,27.25 12.75,28.75
  pour Bottom: 0,49 70,49 70,0 0,0
  pour Route2: 0,49 70,49 70,0 0,0
I_BIAS
  Top 0.254: R26.2 R27.1 R28.2 49.9,33.15 49.5,32.75 49.25,32.5 49.25,31.5 49,31.25 IC5.3
I_FEEDBACK
  Top 0.254: R25.2 R48.1 R29.1 50.1,31.6 49.75,31.25 49.25,30.75 IC5.2
I_NEG  (via drill 0.3)
  Top 0.254: U$4.23 v63.25,26 63.25,26.75 62.75,27.25 56.25,27.25 v55.75,27.25 | IC3.7 42.75,43.75 42.25,44.25 42.15,44.35 R23.2 42.15,45.9 v42.25,46 42.35,46.1 C9.2
  Route15 0.254: v55.75,27.25 55.75,36.25 56,36.5 56.25,36.75 56.25,40 53.25,43 48.75,43 48.25,42.5 47.75,42.5 45.25,45 43.25,45 v42.25,46
I_NEG_FEEDBACK
  Top 0.254: IC3.6 43.25,43.75 43.62,44.12 | 43.62,44.12 43.75,44.25 | R23.1 43.85,44.35 43.62,44.12 | C9.1 43.65,46.1 43.75,46 43.85,45.9 R23.1 | R21.1 46,44 45,45 R23.1
I_NEG_FILTERED  (via drill 0.3)
  Top 0.254: v65.25,25.75 U$4.19 | R26.1 55.9,34.85 56,34.75 56.75,34 v59,34
  Route15 0.254: v65.25,25.75 65.25,26.75 64,28 62.25,28 61.5,28.75 61.5,32.75 60.25,34 v59,34
I_POS  (via drill 0.3)
  Top 0.254: U$4.24 62.75,25.5 v62.5,25.75 61.5,26.75 58.25,26.75 58,26.5 55.25,26.5 55,26.75 v54.75,27 | IC3.1 42.25,40 42,39.75 41.9,39.65 C8.2 40.35,39.65 40.25,39.75 40.15,39.85 R22.2 38.35,39.85 38.25,39.75 37.75,39.25 37.75,37.75 38.5,37 44.5,37 45.25,36.25 49,36.25 49.75,37 v54.75,37
  Route15 0.254: v54.75,37 v54.75,27
I_POS_FEEDACK
  Top 0.254: R22.1 39.9,38.15 40,38.25 40.1,38.35 C8.1 41.6,38.35 42.12,38.88 42.25,39 42.75,39 | IC3.2 42.75,39.5 42.75,39 | R21.2 46,40.75 44.25,39 42.75,39
I_POS_FILTERED  (via drill 0.3)
  Top 0.254: U$4.18 66,24.25 66.25,24.25 66.5,24.5 v66.5,24.75 | R25.1 55,29.75 56.25,29.75 v58.75,29.75
  Route15 0.254: v58.75,29.75 61,27.5 63.5,27.5 64.5,26.5 64.5,25.25 65,24.75 v66.5,24.75
LNA_G2
  Top 0.254: C3.1 63.65,37 U$3.2 63.85,37 R17.1
LP_FREQ_ADJ
  Top 0.254: R13.1 58.25,17.75 57.75,18.25 57.75,20.25 57,21 53.75,21 53.33,20.57 U$6.6
LP_RBIAS
  Top 0.254: U$4.4 61.5,22.75 60.75,22 | 60.75,22 C48.1 | 60.75,22 60.75,20.5 60.85,20.4 R10.2 R13.2
N$3
  Top 0.254: SJ3.2 61,14.85 R6.2
N$4
  Top 0.254: U$7.5 28.75,40.25 29,40.5 29.5,41 30.25,41.75 R39.2 30.15,42.9 30.25,43 R38.2
N$5
  Top 0.254: R5.2 54.75,14.75 55,14.5 SJ4.2
N$7
  Top 0.254: U$13.4 14.4,10.75 R1.1
N$12
  Top 0.254: U$10.24 19.25,22.25 13.75,22.25 13,21.5 LSP1.MP
N$13
  Top 0.254: 24.75,45.85 R37.2 | 24.75,45.85 R14.2 | U$7.6 28.5,40.75 29,41.25 29,42.25 28.5,42.75 25.25,42.75 24.75,43.25 24.75,45.85
N$14
  Top 0.254: U$10.25 21.75,21.75 16.75,21.75 16,21 LSP2.MP
N$15
  Top 0.254: U$13.2 14.4,9.75 R51.1
N$16
  Top 0.254: U$13.3 R52.1
N$17  (via drill 0.3)
  Top 0.254: R35.2 21.85,43.15 v22.75,42.25 22.75,41.75 23.75,40.75 U$7.11 | R36.2 27.1,45.85 v27,45.75
  Route15 0.254: v27,45.75 26.25,45.75 v22.75,42.25
N$18
  Top 0.254: U$7.2 28.25,38.75 29,38 29,35.25 28,34.25 R40.2 28,33.5 27.75,33.25 23.5,33.25 23.25,33.5 R43.2
N$21
  Top 0.254: R42.2 24.85,34.15 24.5,34.5 24.5,36.5 23.25,37.75 23.12,37.88 | U$7.15 24,38.75 23.12,37.88 | 23.12,37.88 22.25,37 21.15,37 R41.2
N$25
  Top 0.254: LSP5.MP 44.5,15.5 46.25,15.5 46.75,15 U$14.21
N$26
  Top 0.254: U$10.37 27.25,15.75 27,15.5 23.5,15.5 LSP3.MP
N$27
  Top 0.254: U$13.5 12.1,12.95 12.15,13 R59.1
N$28
  Top 0.254: SJ7.2 19.75,25 20.25,24.5 20.25,24 20.75,23.5 22.5,23.5 22.75,23.75 U$10.21
N$31
  Top 0.254: U$15.24 9.65,25.4 8.75,24.5 R53.2
N$36
  Top 0.254: U$17.5 34.98,37.48 36,38.5 36.3,38.8 SJ9.1
N$37
  Top 0.254: U$17.6 34.33,35.67 34.5,35.5 35.25,35.5 35.5,35.75 37,37.25 37,41.75 36.75,42 SJ8.1
N$38
  Top 0.254: LED1.C 5,34 R56.2
N$39
  Top 0.254: LED2.C 17.9,20.5 R57.2
N$40
  Top 0.254: U$10.38 27.75,15.5 27.25,15 26,15 LSP4.MP
N$41
  Top 0.254: LSP6.MP 47.25,15.75 U$14.20
N$42
  Top 0.254: U$14.4 46.75,8.25 45,6.5 44.25,6.5 44,6.25 43.25,6.25 LSP7.MP
N$43
  Top 0.254: U$14.5 47.25,8 45.75,6.5 45.75,5.75 LSP8.MP
N$100
  Top 0.254: U$7.3 29.15,39.25 R45.2 R44.2
NXT  (via drill 0.3)
  Top 0.254: U$15.2 17,26.75 17.75,26.75 19.75,28.75 v21.5,28.75 | U$10.11 27.75,28.25 v28.25,28.75
  Route15 0.254: v21.5,28.75 25.5,28.75 v28.25,28.75
PHY_VBUS
  Top 0.254: R54.2 8.5,26.75 9,27.25 U$15.22
PHY_VDD
  Top 0.305: U$15.20 8.75,28.25 8.5,28.5 C32.1
PHY_VDD18  (via drill 0.3)
  Top 0.254: U$15.28 11.75,24.75 11.25,24.25 v11.25,24 11.5,23.75 11.5,23.65 C33.1 | v12.75,24 U$15.30
  Route3 0.61: v11.25,24 v12.75,24
Q_BIAS
  Top 0.254: R31.2 R32.1 44.9,33.4 | 44.9,33.4 45.5,34 R33.2 | IC5.5 45.6,32.15 45,32.75 44.9,32.85 44.9,33.4
Q_FEEDBACK
  Top 0.254: IC5.6 45,31.25 44.62,31.62 | 44.62,31.62 44.5,31.75 | 44.62,31.62 44.4,31.85 R34.1 R49.1 R30.2
Q_NEG  (via drill 0.3)
  Top 0.254: v62.5,19.5 62.75,19.5 63.25,20 U$4.8 | IC4.7 50.75,42.75 50.25,43.25 50.15,43.35 R24.2 50.15,44.9 v50.25,45 50.35,45.1 C11.2
  Route15 0.254: v50.25,45 53,45 62,36 64.25,36 69,31.25 69,25 67.5,23.5 67.5,22 67.75,21.75 67.75,20.5 66.5,19.25 65.25,19.25 64.5,20 63.25,20 62.75,19.5 v62.5,19.5
Q_NEG_FEEDBACK
  Top 0.254: IC4.6 51.25,42.75 51.75,43.25 51.85,43.35 R24.1 | R24.1 51.85,44.9 51.75,45 51.65,45.1 C11.1 | R19.1 54,43 53,44 R24.1
Q_NEG_FILTERD  (via drill 0.3)
  Top 0.254: U$4.13 66.25,21.75 66.5,21.5 v66.5,21.25 | R31.1 41.75,35.75 42,36 44.75,36 45,35.75 v56.5,35.75
  Route15 0.254: v56.5,35.75 56.5,30.75 61.5,25.75 61.5,22.75 62.75,21.5 66.25,21.5 v66.5,21.25
Q_POS  (via drill 0.3)
  Top 0.254: U$4.7 62.75,20.5 v62.5,20.25 | IC4.1 49.6,39.6 49,39 48.65,38.65 C10.2 47.1,38.65 47,38.75 | R20.2 46.9,38.85 47,38.75 | 47,38.75 47,42.5 v47,44.25
  Route15 0.254: v62.5,20.25 62.75,20.5 64.75,20.5 65.5,19.75 66.25,19.75 67.25,20.75 67.25,21.5 67,21.75 67,22 67,22.5 67,24 67.5,24.5 67.5,25.75 66.5,26.75 66.5,32 63.25,35.25 61.75,35.25 53.5,43.5 52,43.5 49.25,43.5 48.5,44.25 v47,44.25
Q_POS_FEEDBACK
  Top 0.254: R20.1 46.9,37.15 47,37.25 47.1,37.35 C10.1 49.1,37.35 49.25,37.5 49.5,37.75 50.75,37.75 | R19.2 54,39.25 52.5,37.75 51.25,37.75 50.75,37.75 | 50.75,37.75 IC4.2
Q_POS_FILTERED  (via drill 0.3)
  Top 0.254: U$4.12 65.25,21 65.25,20.75 65.5,20.5 v65.75,20.5 | R30.1 v39.5,29 41.5,29 42.5,28 43.5,27 49.25,27 50.75,28.5 51,28.75 v57,28.75
  Route15 0.254: v57,28.75 57,26 62,21 65.25,21 v65.75,20.5
QCLK_0  (via drill 0.3)
  Top 0.254: U$2.2 51.88,22.38 52.5,21.75 v52.5,21.25 | R6.1 v58,15 57.25,15.75 51.75,15.75 51.5,16 v51.25,16
  Route15 0.254: v52.5,21.25 51.5,21.25 50.75,20.5 50.5,20.25 50.5,18 51,17.5 51.5,17 51.5,16.25 v51.25,16
QCLK_90  (via drill 0.3)
  Top 0.254: R5.1 51,14.75 50.5,15.25 50.5,16 49.5,17 48.5,17 v48,17.5 | U$2.14 46.48,23.02 v46.5,23
  Route15 0.254: v48,17.5 48,21.5 v46.5,23
QCLK_IR_FF
  Top 0.254: IC1.5 62.65,4.15 62.25,3.75 59.5,3.75 56.25,7 56.25,12.95 SJ4.3
QCLK_IR_FPGA
  Top 0.254: U$14.17 49.6,13.35 50,13.75 52.25,13.75 52.65,13.35 53,13 SJ4.1
QCLK_QR_FF
  Top 0.254: IC1.8 63.95,11.8 63.75,12 62.75,13 SJ3.3
QCLK_QR_FPGA  (via drill 0.3)
  Top 0.254: v58.75,13 SJ3.1 | U$14.16 50,12.75 v50.25,13
  Route15 0.254: v50.25,13 v58.75,13
R_0  (via drill 0.3)
  Top 0.254: IC3.3 43.25,40 v43.5,39.75 | C4.1 53,25.75 52.75,25.5 52.23,24.98 U$2.6 49.77,24.98 v49.75,25 v46.25,25
  Route15 0.254: v43.5,39.75 46.25,37 v46.25,25
R_90  (via drill 0.3)
  Top 0.254: IC4.3 51.25,38.75 v51.5,38.5 | U$2.5 52.58,24.32 v52.75,24.5 C5.1
  Route15 0.254: v52.75,24.5 52.75,28.5 51.5,29.75 v51.5,38.5
R_180  (via drill 0.3)
  Top 0.254: IC3.5 44.6,43.4 v44.75,43.25 | C6.1 53,22 52.75,22.25 51.98,23.02 U$2.3 49.77,23.02 | 49.77,23.02 v49.75,23 | 49.77,23.02 47.98,23.02 v47,24
  Route15 0.254: v44.75,43.25 47,41 v47,24
R_270  (via drill 0.3)
  Top 0.254: IC4.5 52.75,42.4 v52.75,42.25 | U$2.4 52.33,23.68 v52.75,23.25 C7.1
  Route15 0.254: v52.75,23.25 53.5,24 53.5,29.5 52.5,30.5 52.5,35.5 53.5,36.5 53.5,41.5 v52.75,42.25
R_AMPLIFIED  (via drill 0.3)
  Top 0.254: 64.2,33.5 SJ1.1 | 64.2,33.5 U$3.3 64.6,36.35 v65,36.75 | L1.2 63.64,33.5 64.2,33.5 | U$18.9 66.75,42.25 v67.25,41.75
  Route15 0.254: v65,36.75 67.25,39 v67.25,41.75
R_AMPLIFIED_2
  Top 0.254: SJ1.2 66,35.75 66,36 65.8,36.2 U$3.4
R_ANT
  Top 0.254: 63.28,43.63 U$18.4 | J_ANT.2 62.73,45.19 62.73,44.19 63.28,43.63 | C1.1 62.65,43 63.28,43.63
R_ANT_AGC
  Top 0.254: C1.2 61.35,41.5 R16.2 R15.1 64.2,39.8 U$3.1 U$3.6
R_I  (via drill 0.3)
  Top 0.254: 49.5,30 49.6,29.9 R29.2 51.35,29.9 51.65,29.9 R48.2 | IC5.1 49.25,30.25 49.5,30 | U$10.14 26.25,26.75 v27,26 | 49.5,30 49.5,28.25 49,27.75 43.75,27.75 v42.5,29
  Route15 0.254: v42.5,29 40.5,29 39.75,29.75 38.5,31 31.5,31 29.75,29.25 29.75,28.5 28,26.75 27.75,26.75 v27,26
R_Q  (via drill 0.3)
  Top 0.254: IC5.7 45,30.75 44.4,30.15 R34.2 R49.2 40.9,30.15 v40.75,30 | U$10.15 25.75,26.25 v26,26
  Route15 0.254: v40.75,30 39.25,31.5 31.25,31.5 29.25,29.5 29.25,28.75 28,27.5 27.5,27.5 v26,26
SCL_CLKGEN  (via drill 0.3)
  Top 0.254: U$1.1 26.83,11.17 26.25,11.75 26.15,11.85 R65.1 26.15,13.9 v26.25,14 | U$10.58 33,22.75 v30,22.75
  Route3 0.254: v30,22.75 26.25,19 v26.25,14
SDA_CLKGEN  (via drill 0.3)
  Top 0.254: U$1.2 27.62,9.62 28,10 28,11 29,12 29.15,12.15 R66.1 29.15,13.9 v29.5,14.25 | U$10.59 31.75,23.25 v31.5,23.5
  Route3 0.254: v29.5,14.25 29.5,15 28.25,16.25 27.75,16.75 27.75,18 31.75,22 31.75,23.25 v31.5,23.5
SDIO_CK  (via drill 0.3)
  Top 0.254: U$10.53 34,20.25 33.5,19.75 v32.5,19.75 | JP2.5 27.73,4.23 28.5,5 v28.5,9
  Route15 0.254: v28.5,9 28.5,9.75 30,11.25 30,12.5 30,13 34,17 34,19.25 33.5,19.75 v32.5,19.75
SDIO_CMD  (via drill 0.3)
  Top 0.254: U$10.54 33.5,20.75 v33.25,20.5 | JP2.3 32.81,2.69 31.75,3.75 31,3.75 30,4.75 29.25,5.5 v29.25,8.5
  Route15 0.254: v29.25,8.5 29.25,9.25 31.5,11.5 31.5,12.75 31.5,13.75 34.5,16.75 34.5,19.75 33.75,20.5 v33.25,20.5
SDIO_D0  (via drill 0.3)
  Top 0.254: U$10.39 28.25,15.25 28,15 v28,14.5 | JP2.7 22.65,9.15 23,9.5 v24.5,11
  Route15 0.254: v24.5,11 v28,14.5
SDIO_D1  (via drill 0.3)
  Top 0.254: v28.75,14.75 U$10.40 | JP2.8 20.11,8.86 v20.5,9.25
  Route15 0.254: v20.5,9.25 24,9.25 28.5,13.75 28.5,14 28.75,14.25 v28.75,14.75
SDIO_D2  (via drill 0.3)
  Top 0.254: U$10.51 36,19.25 v36.25,19.25 | JP2.1 37.75,2 36,3.75 36,4.5 35.75,4.75 31.5,4.75 30.75,5.5 v30.75,7.5
  Route15 0.254: v30.75,7.5 30.75,8 34.75,12 36.5,13.75 36.5,19 v36.25,19.25
SDIO_D3  (via drill 0.3)
  Top 0.254: U$10.52 35.5,19.75 v35.75,20 | JP2.2 35.35,3.9 35,4.25 31.25,4.25 30,5.5 v30,8
  Route15 0.254: v30,8 34.5,12.5 36,14 36,17 35,18 35,19.25 v35.75,20
SPI_MISO  (via drill 0.3)
  Top 0.254: v67.25,17.75 65.25,19.75 64.75,20.25 U$4.11 | U$14.10 v50.25,9.75 53.25,9.75 53.5,9.75 v55.5,11.75 | U$10.22 25.75,23.25 v30,19
  Route3 0.254: v30,19 28.5,17.5 28.5,17 29.25,16.25 37.75,16.25 41,13 41,10.5 42.25,9.25 49.75,9.25 v50.25,9.75
  Route15 0.254: v55.5,11.75 65.5,11.75 67.25,13.5 v67.25,17.75
SPI_MOSI  (via drill 0.3)
  Top 0.254: v64.5,19 64.5,19.75 64.25,20 U$4.10 | U$14.25 44.5,12.75 41.12,16.12 41,16.25 41,17.25 | U$6.8 51.44,19.81 v51.25,20 43,20 41,18 41,17.25 | U$10.23 25.25,22.75 v26.25,21.75 | 41,17.25 32.25,17.25 31.75,17.75 31.75,20.25 v31.5,20.5 | U$17.8 33.02,35.27 32.5,34.75 32.5,33 33,32.5 35,30.5 v35,29.5
  Route15 0.254: v26.25,21.75 26.75,21.75 29,24 30,24 31.5,22.5 31.5,21.25 | 31.5,21.25 v31.5,20.5 | v64.5,19 64.25,19.25 64,19.5 63.5,19.5 63.25,19.25 62.75,18.75 54,18.75 53,19.75 52.75,20 v51.25,20 | v35,29.5 35,22.5 33.75,21.25 31.5,21.25
SPI_SCK  (via drill 0.3)
  Top 0.254: v63.75,18.75 63.75,19.5 63.75,19.75 U$4.9 | U$14.9 49.75,9.25 v50.25,8.75 | v50.75,16.75 51.19,17.19 U$6.1 52.02,16.48 52.25,16.25 63,16.25 | U$10.55 35.5,21.25 v35.75,21 | U$17.1 33.02,33.23 34,32.25 35.75,30.5 35.75,29.25 v36,29 | 63,16.25 v63.5,16.25 63,16.25
  Route15 0.254: v50.25,8.75 49.75,9.25 49.5,9.5 49.5,13.5 | 49.5,13.5 49.5,14 50,14.5 50,16 v50.75,16.75 | 49.5,13.5 43.75,13.5 41,16.25 41,18.75 39.25,20.5 36.25,20.5 v35.75,21 35.75,25.75 36.75,26.75 36.75,28.25 36.25,28.75 v36,29 | v63.5,16.25 63.5,18.5 v63.75,18.75
STP  (via drill 0.3)
  Top 0.254: U$15.29 12.25,24.5 12,24.25 12,23.75 12.5,23.25 17,23.25 v17.25,23
  Top 0.305: U$10.8 29.25,26 v29.5,25.75
  Route15 0.254: v17.25,23 19.25,23 27.25,23 29.5,25.25 v29.5,25.75
SWCLK  (via drill 0.3)
  Top 0.254: U$10.49 33.5,18.25 v33.25,18.5
  Route15 0.254: JP3.2 5.19,7.94 9.75,12.5 18,12.5 20.5,15 25,15 26.25,16.25 26.5,16.5 29.75,19.75 30.75,19.75 32,18.5 v33.25,18.5
SWDIO  (via drill 0.3)
  Top 0.254: U$10.46 31.75,15.75 v31.25,15.25 | R50.2 9.85,4.15 10,4 10.25,3.75 10.27,3.73 JP3.4
  Route15 0.254: JP3.4 10.25,2 10.25,8.75 13.25,11.75 18.25,11.75 21,14.5 25.5,14.5 26.25,15.25 26.5,15.5 29.5,15.5 29.75,15.25 v31.25,15.25
T_0  (via drill 0.3)
  Top 0.254: U$7.1 28,37.67 v28,37 R40.1 R42.1 | U$2.10 43.88,25.62 v43,26.5 42.75,26.75 41.25,28.25 38.75,28.25 35.5,28.25 35.25,28.25 34.25,29.25 34.25,30.5 33.25,31.5 31.75,31.5 31,32.25 30.5,32.75 v30.5,33.75
  Route15 0.254: v28,37 28.75,36.25 28.75,35.5 v30.5,33.75
T_90  (via drill 0.3)
  Top 0.254: R14.1 R36.1 28.1,44.15 v29,43.25 | U$7.7 28,41.25 v28.25,41.5 | U$2.11 43.52,24.98 v42.75,25.75 40.75,27.75 38.75,27.75 35,27.75 33.75,29 33.75,29.25 33.75,30.25 33,31 31,31 29.75,32.25 29.5,32.5 v29.5,33.75
  Route15 0.254: v29,43.25 29,42.25 v28.25,41.5 28.25,38.25 27.25,37.25 27.25,36.5 28,35.75 28,35.25 v29.5,33.75
T_180  (via drill 0.3)
  Top 0.254: R41.1 21.4,35.15 22,35.75 v22.25,35.75 23.15,35.75 R43.1 | U$7.16 24.57,37.42 v24.75,37.25 | U$2.13 43.17,23.68 v43,23.5 | R44.1 31.85,33.35 v31.75,33.25
  Route15 0.254: v22.25,35.75 23.75,37.25 v24.75,37.25 29,33 31.5,33 v31.75,33.25 35.75,33.25 36,33 38.75,33 42,29.75 43,29.75 43.25,29.5 43.25,27.75 42,26.5 41.5,26 41.25,25.75 41.25,24.25 42,23.5 v43,23.5
T_270  (via drill 0.3)
  Top 0.254: U$7.10 24.25,41.25 23.5,42 R37.1 22.6,44.15 22.5,44.25 21.9,44.85 R35.1 21,46.25 22.25,47.5 29.5,47.5 30.25,46.75 R38.1 40.85,45.85 v41,46 | U$2.12 43.17,24.32 v43,24.5
  Route15 0.254: v41,46 41.75,45.25 41.75,40.75 41.5,40.5 41.25,40.25 41.25,31.25 41.5,31 41.75,30.75 43.5,30.75 44.5,29.75 44.5,26 v43,24.5
T_ANT  (via drill 0.3)
  Top 0.254: U$18.6 64.86,42.37 v64.5,42 | v66.25,44.5 U$18.2
  Route15 0.254: v64.5,42 66.25,43.75 v66.25,44.5
T_CM
  Top 0.254: R46.1 R47.2 23,39 23.25,39.25 | 23.25,39.25 23.25,39.75 23.75,40.25 U$7.12 | 23.25,39.25 U$7.14
T_EN  (via drill 0.3)
  Top 0.254: U$18.1 66.75,44 v67.25,44.5 | v64.25,43 U$18.5 | U$10.56 35.5,21.75 35.75,22 v39,22
  Route3 0.254: v67.25,44.5 67.25,44.25 66,43 v64.25,43 49,43 48,42 43,42 41.5,40.5 41,40 41,39.5 41.5,39 41.5,27.75 41,27.25 41,23 40,22 v39,22
T_I
  Top 0.254: R45.1 34.25,38.25 35,39 SJ9.2
T_Q
  Top 0.254: R39.1 31.85,42.6 32.75,43.5 34.5,43.5 35,43 SJ8.2
TCK  (via drill 0.3)
  Top 0.254: U$14.30 44,10.25 43.75,10.25 v43.5,10 43.25,9.75 R100.2
  Route3 0.254: JP4.8 59.89,2.61 55.5,7 55.5,10.5 51.75,14.25 46.25,14.25 43.5,11.5 43,11.5 42.5,11 42.5,10.5 | 43,10 42.5,10.5 | 43,10 42.5,10.5 | v43.5,10 43,10
TDI  (via drill 0.3)
  Top 0.254: U$14.32 44.5,9.25 44,8.75 v44,8
  Route3 0.254: JP4.2 44.65,3.35 43.5,4.5 43.5,6.25 44,6.75 v44,8
TDO  (via drill 0.3)
  Top 0.254: U$14.1 45.25,8.5 v44.75,8
  Route3 0.254: JP4.3 47.19,5.56 v44.75,8
TMS  (via drill 0.3)
  Top 0.254: v43.25,10.75 U$14.29
  Route3 0.254: JP4.6 54.81,10.44 51.75,13.5 51.5,13.75 46.5,13.75 43.5,10.75 v43.25,10.75
UC_DAC1  (via drill 0.3)
  Top 0.254: SJ9.3 33.7,39.7 v33,39 | U$10.20 24.25,24.25 v24.5,24.5
  Route15 0.254: v33,39 32.5,39 31.25,40.25 31.25,42 29,44.25 27.5,44.25 19.75,36.5 19.75,29.25 v24.5,24.5
UC_DAC2  (via drill 0.3)
  Top 0.254: SJ8.3 33.7,41.7 v33,41 | SJ7.1 19,27 v19.25,27.25
  Route15 0.254: v19.25,27.25 19.25,36.75 20,37.5 20.5,38 26.5,44 27.25,44.75 29.25,44.75 v33,41
UC_LED
  Top 0.254: U$10.28 22.25,20.25 22,20.5 LED2.A
USB_D+
  Top 0.254: X1.3 10,41 11,40 11,35.25 10.75,35 SJ6.2
USB_D-
  Top 0.254: X1.2 10.2,41.8 11.5,40.5 11.75,40.25 11.75,35.25 12,35 SJ5.2
USB_FS_D+  (via drill 0.3)
  Top 0.254: U$10.45 31.25,19.75 25.5,25.5 25,26 25,26.5 24.5,27 v24.5,27.75 | SJ5.1 12.75,37.25 v12.5,37.5
  Route3 0.254: v12.5,37.5 12.25,37.5 11.75,37 11.75,36.25 14,34 18.25,34 v24.5,27.75
USB_FS_D-  (via drill 0.3)
  Top 0.254: U$10.44 30.75,19.5 25,25.25 24.5,25.75 24.5,26.25 23.5,27.25 v23.5,27.75 | SJ6.1 10,37.25 v10.25,37.5
  Route3 0.254: v10.25,37.5 11,36.75 11,36 13.75,33.25 18,33.25 v23.5,27.75
USB_HS_D+  (via drill 0.3)
  Top 0.254: SJ6.3 10.45,33.7 10.7,33.7 v11,34 | U$15.18 9.25,29.25 8.5,30 v8.25,30.25
  Route15 0.254: v8.25,30.25 11,33 v11,34
USB_HS_D-  (via drill 0.3)
  Top 0.254: SJ5.3 12.2,33.7 11.95,33.7 v11.75,33.5 | U$15.19 9,28.75 8.5,29.25 v8.25,29.25
  Route15 0.254: v8.25,29.25 11.75,32.75 v11.75,33.5
USB_ID  (via drill 0.3)
  Top 0.254: X1.4 8.8,40.2 8.95,40.2 v9,40.25 | U$15.23 9.25,26.75 9,26.5 9,26 v8.75,25.75
  Route3 0.254: v9,40.25 9.5,39.75 9.5,26.5 v8.75,25.75
VAGC  (via drill 0.3)
  Top 0.254: U$6.5 54.56,19.81 v54.75,20 | R18.2 57.9,35.15 57.75,35 v57.75,34.75
  Route3 0.254: v57.75,34.75 57.75,24.75 57,24 57,22.25 v54.75,20
VCAP1
  Top 0.305: C18.1 22.25,19 22.5,18.75 U$10.31
VCAP2
  Top 0.254: C19.1 U$10.47
VCC_FILTER_UNFILT
  Top 0.254: SJ10.2 L3.1
VCC_MIXER_FILTERED
  Top 0.254: C16.1 42.67,21.68 L3.2 43.25,21 44,21.75 44.81,21.75 U$2.16
VCC_RT_SWITCH  (via drill 0.3)
  Top 0.254: U$18.8 66.25,42 66.5,41.75 v66.5,41.5 | SJ2.2 v61,44
  Route15 0.254: v66.5,41.5 66.5,41.25 66,40.75 64.25,40.75 v61,44